# EAGLE design SC01 Breakout V0.1 (EAGLE 9.6.2)

## Sheet 1 of 2: Circuit Diagram
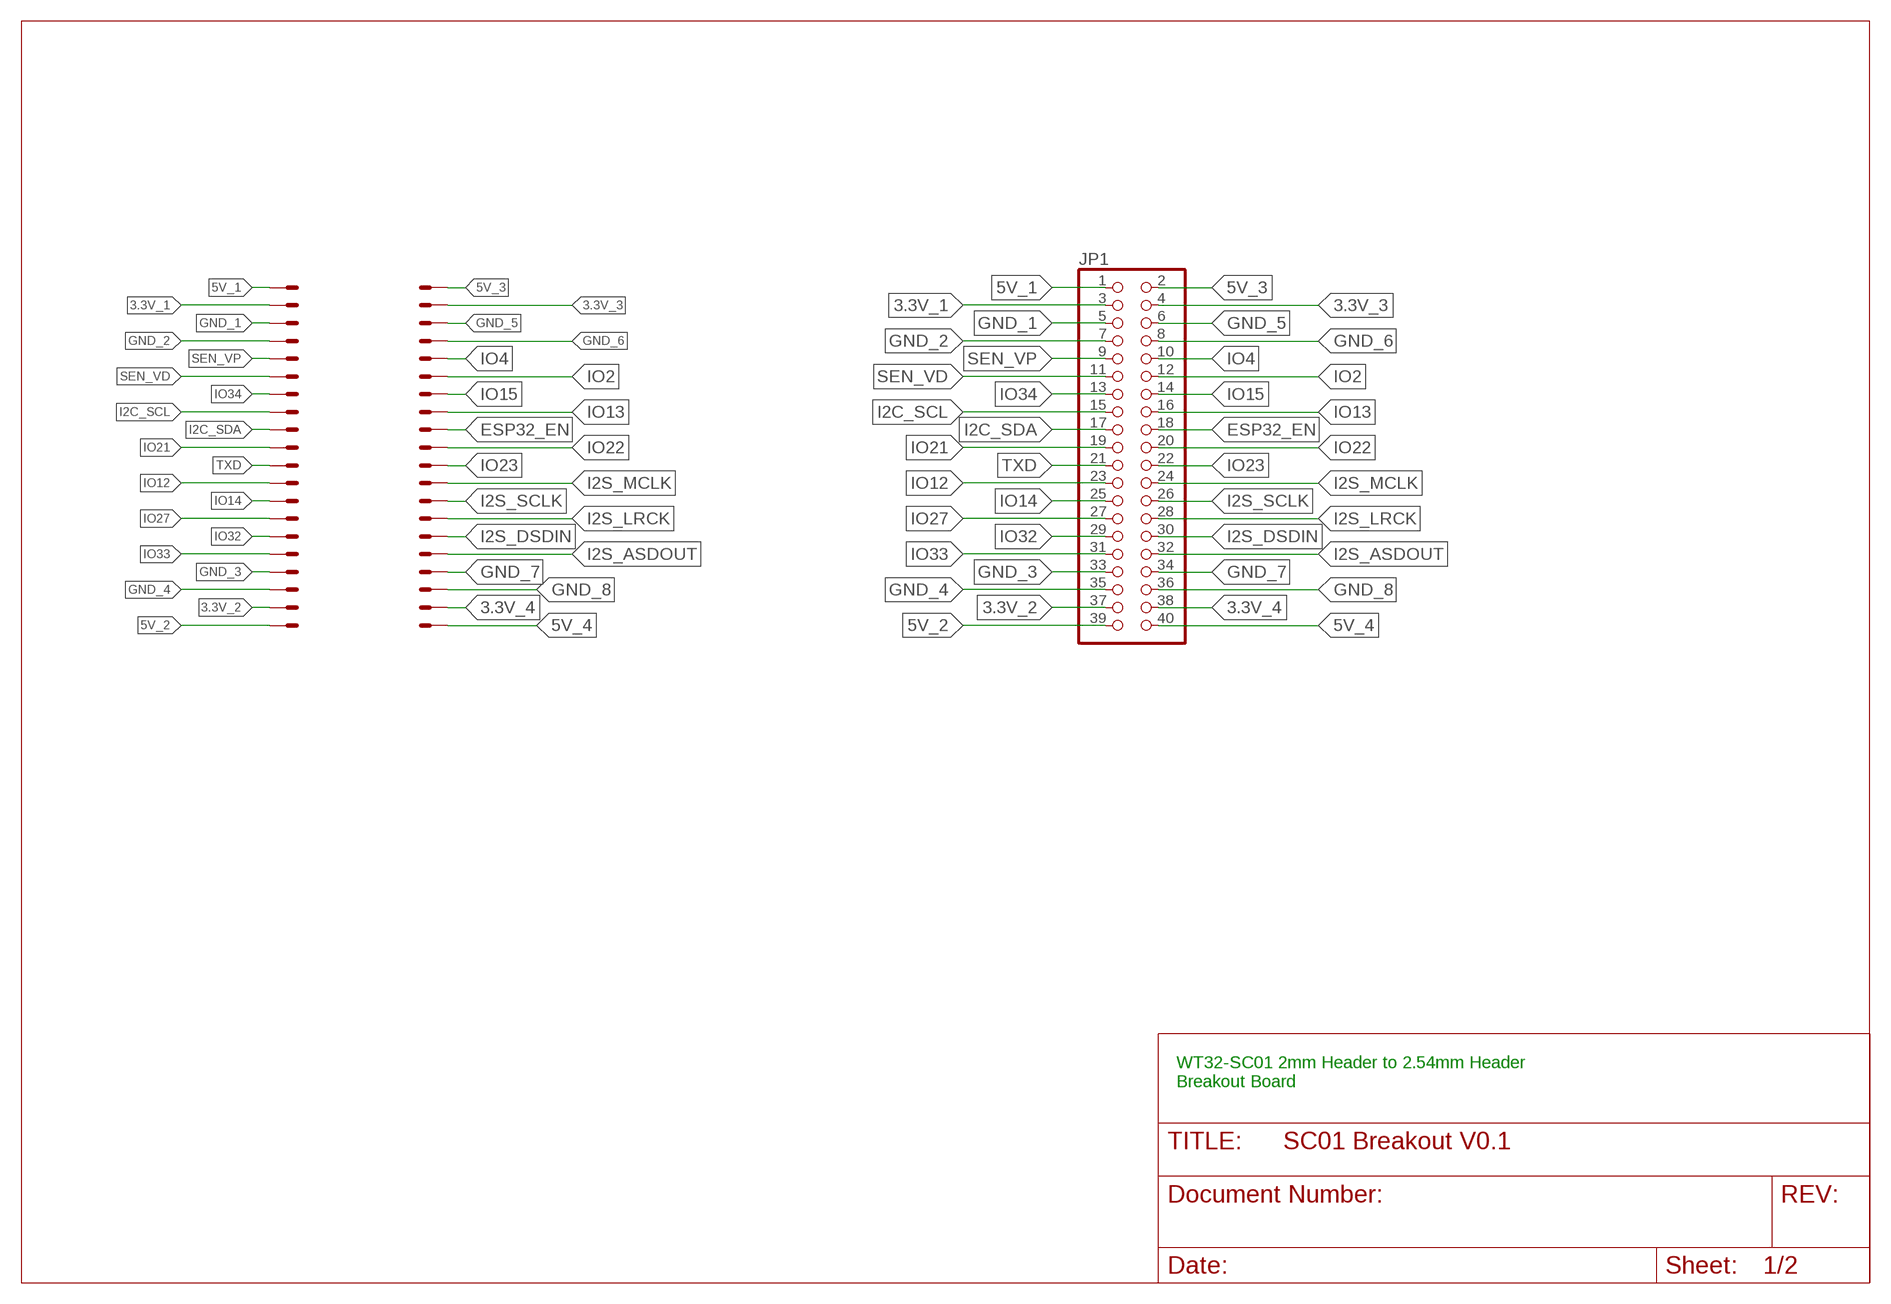
[diagram p0: schematic, sheet 1]

### Parts
JP1  PINHD-2X20  [2X20]
X1  87758-4016  [87758-4016]

### Nets
3.3V_1: JP1.3 X1.3
3.3V_2: JP1.37 X1.37
3.3V_3: JP1.4 X1.4
3.3V_4: JP1.38 X1.38
5V_1: JP1.1 X1.1
5V_2: JP1.39 X1.39
5V_3: JP1.2 X1.2
5V_4: JP1.40 X1.40
ESP32_EN: JP1.18 X1.18
GND_1: JP1.5 X1.5
GND_2: JP1.7 X1.7
GND_3: JP1.33 X1.33
GND_4: JP1.35 X1.35
GND_5: JP1.6 X1.6
GND_6: JP1.8 X1.8
GND_7: JP1.34 X1.34
GND_8: JP1.36 X1.36
I2C_SCL: JP1.15 X1.15
I2C_SDA: JP1.17 X1.17
I2S_ASDOUT: JP1.32 X1.32
I2S_DSDIN: JP1.30 X1.30
I2S_LRCK: JP1.28 X1.28
I2S_MCLK: JP1.24 X1.24
I2S_SCLK: JP1.26 X1.26
IO2: JP1.12 X1.12
IO4: JP1.10 X1.10
IO12: JP1.23 X1.23
IO13: JP1.16 X1.16
IO14: JP1.25 X1.25
IO15: JP1.14 X1.14
IO21: JP1.19 X1.19
IO22: JP1.20 X1.20
IO23: JP1.22 X1.22
IO27: JP1.27 X1.27
IO32: JP1.29 X1.29
IO33: JP1.31 X1.31
IO34: JP1.13 X1.13
SEN_VD: JP1.11 X1.11
SEN_VP: JP1.9 X1.9
TXD: JP1.21 X1.21

### Notes on the sheet
- WT32-SC01 2mm Header to 2.54mm Header
  Breakout Board

## Sheet 2 of 2
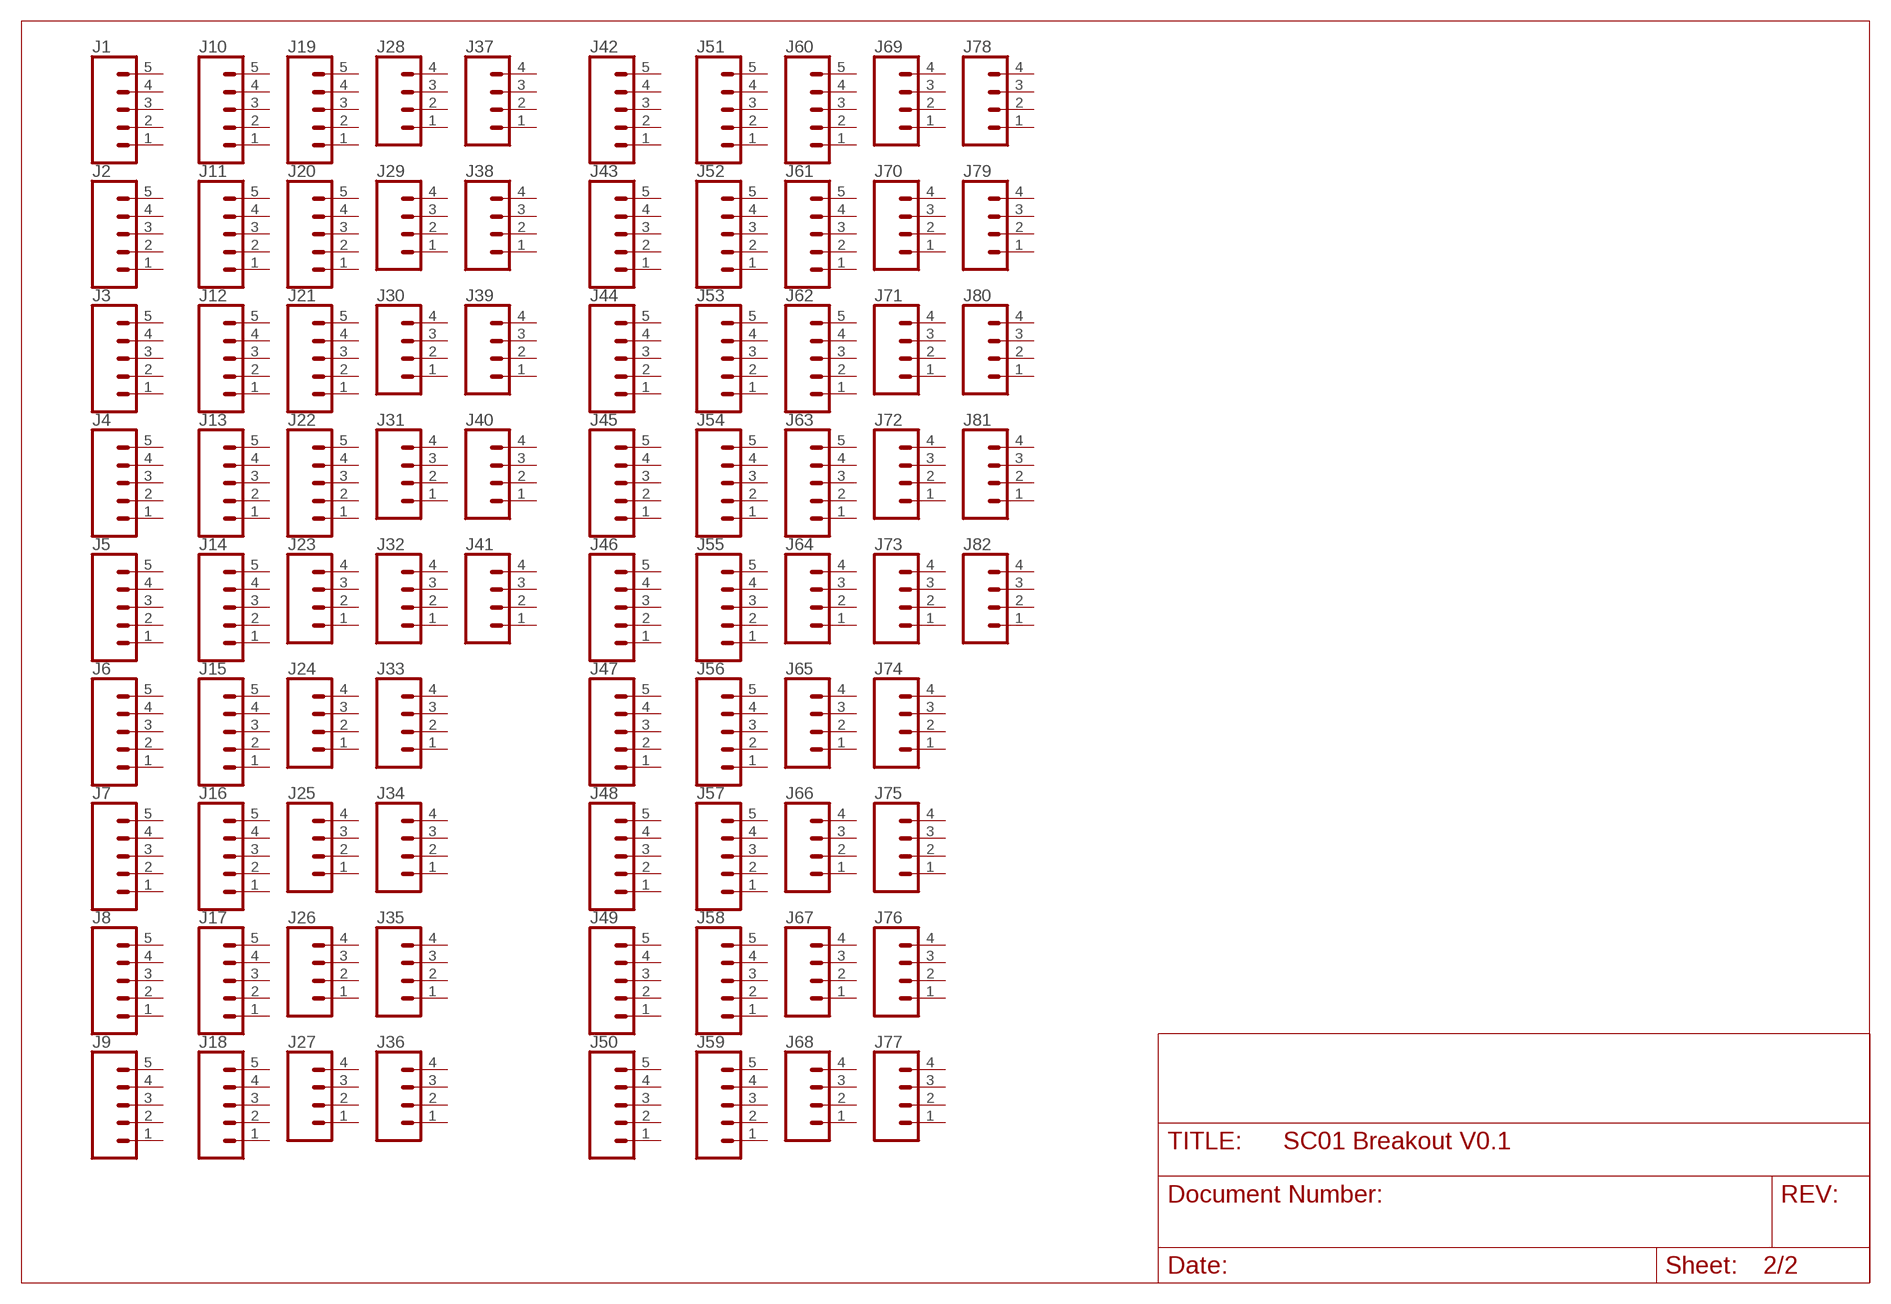
[diagram p1: schematic, sheet 2]

### Parts
J1  CONN_05NO_SILK  [1X05_NO_SILK]
J2  CONN_05NO_SILK  [1X05_NO_SILK]
J3  CONN_05NO_SILK  [1X05_NO_SILK]
J4  CONN_05NO_SILK  [1X05_NO_SILK]
J5  CONN_05NO_SILK  [1X05_NO_SILK]
J6  CONN_05NO_SILK  [1X05_NO_SILK]
J7  CONN_05NO_SILK  [1X05_NO_SILK]
J8  CONN_05NO_SILK  [1X05_NO_SILK]
J9  CONN_05NO_SILK  [1X05_NO_SILK]
J10  CONN_05NO_SILK  [1X05_NO_SILK]
J11  CONN_05NO_SILK  [1X05_NO_SILK]
J12  CONN_05NO_SILK  [1X05_NO_SILK]
J13  CONN_05NO_SILK  [1X05_NO_SILK]
J14  CONN_05NO_SILK  [1X05_NO_SILK]
J15  CONN_05NO_SILK  [1X05_NO_SILK]
J16  CONN_05NO_SILK  [1X05_NO_SILK]
J17  CONN_05NO_SILK  [1X05_NO_SILK]
J18  CONN_05NO_SILK  [1X05_NO_SILK]
J19  CONN_05NO_SILK  [1X05_NO_SILK]
J20  CONN_05NO_SILK  [1X05_NO_SILK]
J21  CONN_05NO_SILK  [1X05_NO_SILK]
J22  CONN_05NO_SILK  [1X05_NO_SILK]
J23  CONN_041X04_NO_SILK  [1X04_NO_SILK]
J24  CONN_041X04_NO_SILK  [1X04_NO_SILK]
J25  CONN_041X04_NO_SILK  [1X04_NO_SILK]
J26  CONN_041X04_NO_SILK  [1X04_NO_SILK]
J27  CONN_041X04_NO_SILK  [1X04_NO_SILK]
J28  CONN_041X04_NO_SILK  [1X04_NO_SILK]
J29  CONN_041X04_NO_SILK  [1X04_NO_SILK]
J30  CONN_041X04_NO_SILK  [1X04_NO_SILK]
J31  CONN_041X04_NO_SILK  [1X04_NO_SILK]
J32  CONN_041X04_NO_SILK  [1X04_NO_SILK]
J33  CONN_041X04_NO_SILK  [1X04_NO_SILK]
J34  CONN_041X04_NO_SILK  [1X04_NO_SILK]
J35  CONN_041X04_NO_SILK  [1X04_NO_SILK]
J36  CONN_041X04_NO_SILK  [1X04_NO_SILK]
J37  CONN_041X04_NO_SILK  [1X04_NO_SILK]
J38  CONN_041X04_NO_SILK  [1X04_NO_SILK]
J39  CONN_041X04_NO_SILK  [1X04_NO_SILK]
J40  CONN_041X04_NO_SILK  [1X04_NO_SILK]
J41  CONN_041X04_NO_SILK  [1X04_NO_SILK]
J42  CONN_05NO_SILK  [1X05_NO_SILK]
J43  CONN_05NO_SILK  [1X05_NO_SILK]
J44  CONN_05NO_SILK  [1X05_NO_SILK]
J45  CONN_05NO_SILK  [1X05_NO_SILK]
J46  CONN_05NO_SILK  [1X05_NO_SILK]
J47  CONN_05NO_SILK  [1X05_NO_SILK]
J48  CONN_05NO_SILK  [1X05_NO_SILK]
J49  CONN_05NO_SILK  [1X05_NO_SILK]
J50  CONN_05NO_SILK  [1X05_NO_SILK]
J51  CONN_05NO_SILK  [1X05_NO_SILK]
J52  CONN_05NO_SILK  [1X05_NO_SILK]
J53  CONN_05NO_SILK  [1X05_NO_SILK]
J54  CONN_05NO_SILK  [1X05_NO_SILK]
J55  CONN_05NO_SILK  [1X05_NO_SILK]
J56  CONN_05NO_SILK  [1X05_NO_SILK]
J57  CONN_05NO_SILK  [1X05_NO_SILK]
J58  CONN_05NO_SILK  [1X05_NO_SILK]
J59  CONN_05NO_SILK  [1X05_NO_SILK]
J60  CONN_05NO_SILK  [1X05_NO_SILK]
J61  CONN_05NO_SILK  [1X05_NO_SILK]
J62  CONN_05NO_SILK  [1X05_NO_SILK]
J63  CONN_05NO_SILK  [1X05_NO_SILK]
J64  CONN_041X04_NO_SILK  [1X04_NO_SILK]
J65  CONN_041X04_NO_SILK  [1X04_NO_SILK]
J66  CONN_041X04_NO_SILK  [1X04_NO_SILK]
J67  CONN_041X04_NO_SILK  [1X04_NO_SILK]
J68  CONN_041X04_NO_SILK  [1X04_NO_SILK]
J69  CONN_041X04_NO_SILK  [1X04_NO_SILK]
J70  CONN_041X04_NO_SILK  [1X04_NO_SILK]
J71  CONN_041X04_NO_SILK  [1X04_NO_SILK]
J72  CONN_041X04_NO_SILK  [1X04_NO_SILK]
J73  CONN_041X04_NO_SILK  [1X04_NO_SILK]
J74  CONN_041X04_NO_SILK  [1X04_NO_SILK]
J75  CONN_041X04_NO_SILK  [1X04_NO_SILK]
J76  CONN_041X04_NO_SILK  [1X04_NO_SILK]
J77  CONN_041X04_NO_SILK  [1X04_NO_SILK]
J78  CONN_041X04_NO_SILK  [1X04_NO_SILK]
J79  CONN_041X04_NO_SILK  [1X04_NO_SILK]
J80  CONN_041X04_NO_SILK  [1X04_NO_SILK]
J81  CONN_041X04_NO_SILK  [1X04_NO_SILK]
J82  CONN_041X04_NO_SILK  [1X04_NO_SILK]
Unconnected: J1.1 J1.2 J1.3 J1.4 J1.5 J2.1 J2.2 J2.3 J2.4 J2.5 J3.1 J3.2 J3.3 J3.4 J3.5 J4.1 J4.2 J4.3 J4.4 J4.5 J5.1 J5.2 J5.3 J5.4 J5.5 J6.1 J6.2 J6.3 J6.4 J6.5 J7.1 J7.2 J7.3 J7.4 J7.5 J8.1 J8.2 J8.3 J8.4 J8.5 J9.1 J9.2 J9.3 J9.4 J9.5 J10.1 J10.2 J10.3 J10.4 J10.5 J11.1 J11.2 J11.3 J11.4 J11.5 J12.1 J12.2 J12.3 J12.4 J12.5 J13.1 J13.2 J13.3 J13.4 J13.5 J14.1 J14.2 J14.3 J14.4 J14.5 J15.1 J15.2 J15.3 J15.4 J15.5 J16.1 J16.2 J16.3 J16.4 J16.5 J17.1 J17.2 J17.3 J17.4 J17.5 J18.1 J18.2 J18.3 J18.4 J18.5 J19.1 J19.2 J19.3 J19.4 J19.5 J20.1 J20.2 J20.3 J20.4 J20.5 J21.1 J21.2 J21.3 J21.4 J21.5 J22.1 J22.2 J22.3 J22.4 J22.5 J23.1 J23.2 J23.3 J23.4 J24.1 J24.2 J24.3 J24.4 J25.1 J25.2 J25.3 J25.4 J26.1 J26.2 J26.3 J26.4 J27.1 J27.2 J27.3 J27.4 J28.1 J28.2 J28.3 J28.4 J29.1 J29.2 J29.3 J29.4 J30.1 J30.2 J30.3 J30.4 J31.1 J31.2 J31.3 J31.4 J32.1 J32.2 J32.3 J32.4 J33.1 J33.2 J33.3 J33.4 J34.1 J34.2 J34.3 J34.4 J35.1 J35.2 J35.3 J35.4 J36.1 J36.2 J36.3 J36.4 J37.1 J37.2 J37.3 J37.4 J38.1 J38.2 J38.3 J38.4 J39.1 J39.2 J39.3 J39.4 J40.1 J40.2 J40.3 J40.4 J41.1 J41.2 J41.3 J41.4 J42.1 J42.2 J42.3 J42.4 J42.5 J43.1 J43.2 J43.3 J43.4 J43.5 J44.1 J44.2 J44.3 J44.4 J44.5 J45.1 J45.2 J45.3 J45.4 J45.5 J46.1 J46.2 J46.3 J46.4 J46.5 J47.1 J47.2 J47.3 J47.4 J47.5 J48.1 J48.2 J48.3 J48.4 J48.5 J49.1 J49.2 J49.3 J49.4 J49.5 J50.1 J50.2 J50.3 J50.4 J50.5 J51.1 J51.2 J51.3 J51.4 J51.5 J52.1 J52.2 J52.3 J52.4 J52.5 J53.1 J53.2 J53.3 J53.4 J53.5 J54.1 J54.2 J54.3 J54.4 J54.5 J55.1 J55.2 J55.3 J55.4 J55.5 J56.1 J56.2 J56.3 J56.4 J56.5 J57.1 J57.2 J57.3 J57.4 J57.5 J58.1 J58.2 J58.3 J58.4 J58.5 J59.1 J59.2 J59.3 J59.4 J59.5 J60.1 J60.2 J60.3 J60.4 J60.5 J61.1 J61.2 J61.3 J61.4 J61.5 J62.1 J62.2 J62.3 J62.4 J62.5 J63.1 J63.2 J63.3 J63.4 J63.5 J64.1 J64.2 J64.3 J64.4 J65.1 J65.2 J65.3 J65.4 J66.1 J66.2 J66.3 J66.4 J67.1 J67.2 J67.3 J67.4 J68.1 J68.2 J68.3 J68.4 J69.1 J69.2 J69.3 J69.4 J70.1 J70.2 J70.3 J70.4 J71.1 J71.2 J71.3 J71.4 J72.1 J72.2 J72.3 J72.4 J73.1 J73.2 J73.3 J73.4 J74.1 J74.2 J74.3 J74.4 J75.1 J75.2 J75.3 J75.4 J76.1 J76.2 J76.3 J76.4 J77.1 J77.2 J77.3 J77.4 J78.1 J78.2 J78.3 J78.4 J79.1 J79.2 J79.3 J79.4 J80.1 J80.2 J80.3 J80.4 J81.1 J81.2 J81.3 J81.4 J82.1 J82.2 J82.3 J82.4

## Library data of the parts
J1-J22 J42-J63 = SparkFun-Connectors:CONN_05: Multi connection point. Often used as Generic Header-pin footprint for 0.1 inch spaced/style header connections On any of the 0.1 inch spaced packages, you can populate with these: Break Away Headers - Straight <https://www.sparkfun.com/products/116> (PRT-00116) Break Away Male Headers - Right Angle <https://www.sparkfun.com/products/553> (PRT-00553) Female Headers <https://www.sparkfun.com/products/115> (PRT-00115) Break Away Headers - Machine Pin <https://www.sparkfun.com/products/117> (PRT-00117) Break Away Female Headers - Swiss Machine Pin <https://www.sparkfun.com/products/743> (PRT-00743) For SCREWTERMINALS and SPRING TERMINALS visit here: Screw Terimnals on SparkFun.com <https://www.sparkfun.com/search/results?term=Screw+Terminals> (5mm/3.5mm/2.54mm spacing) This device is also useful as a general connection point to wire up your design to another part of your project. Our various solder wires solder well into these plated through hole pads. Hook-Up Wire - Assortment (Stranded, 22 AWG) <https://www.sparkfun.com/products/11375> (PRT-11375) Hook-Up Wire - Assortment (Solid Core, 22 AWG) <https://www.sparkfun.com/products/11367> (PRT-11367) View the entire wire category on our website here <https://www.sparkfun.com/categories/141> Special notes: Molex polarized connector foot print use with SKU : PRT-08231 with associated crimp pins and housings. 1MM SMD Version SKU: PRT-10208
J23-J41 J64-J82 = SparkFun-Connectors:CONN_04: Multi connection point. Often used as Generic Header-pin footprint for 0.1 inch spaced/style header connections On any of the 0.1 inch spaced packages, you can populate with these: Break Away Headers - Straight <https://www.sparkfun.com/products/116> (PRT-00116) Break Away Male Headers - Right Angle <https://www.sparkfun.com/products/553> (PRT-00553) Female Headers <https://www.sparkfun.com/products/115> (PRT-00115) Break Away Headers - Machine Pin <https://www.sparkfun.com/products/117> (PRT-00117) Break Away Female Headers - Swiss Machine Pin <https://www.sparkfun.com/products/743> (PRT-00743) For SCREWTERMINALS and SPRING TERMINALS visit here: Screw Terimnals on SparkFun.com <https://www.sparkfun.com/search/results?term=Screw+Terminals> (5mm/3.5mm/2.54mm spacing) This device is also useful as a general connection point to wire up your design to another part of your project. Our various solder wires solder well into these plated through hole pads. Hook-Up Wire - Assortment (Stranded, 22 AWG) <https://www.sparkfun.com/products/11375> (PRT-11375) Hook-Up Wire - Assortment (Solid Core, 22 AWG) <https://www.sparkfun.com/products/11367> (PRT-11367) View the entire wire category on our website here <https://www.sparkfun.com/categories/141> Special notes: Molex polarized connector foot print use with SKU : PRT-08231 with associated crimp pins and housings. 1MM SMD Version SKU: PRT-10208; PROD_ID: CONN-09696
JP1 = pinhead:PINHD-2X20: PIN HEADER
X1 = con-molex:87758-4016: 40 Pin - 2mm Dual Row Single Wafer, Vertical T/H HDR Source: http://www.molex.com/pdm_docs/sd/877580616_sd.pdf; MPN: 87758-4016; OC_FARNELL: unknown; OC_NEWARK: 25M5691

## Board
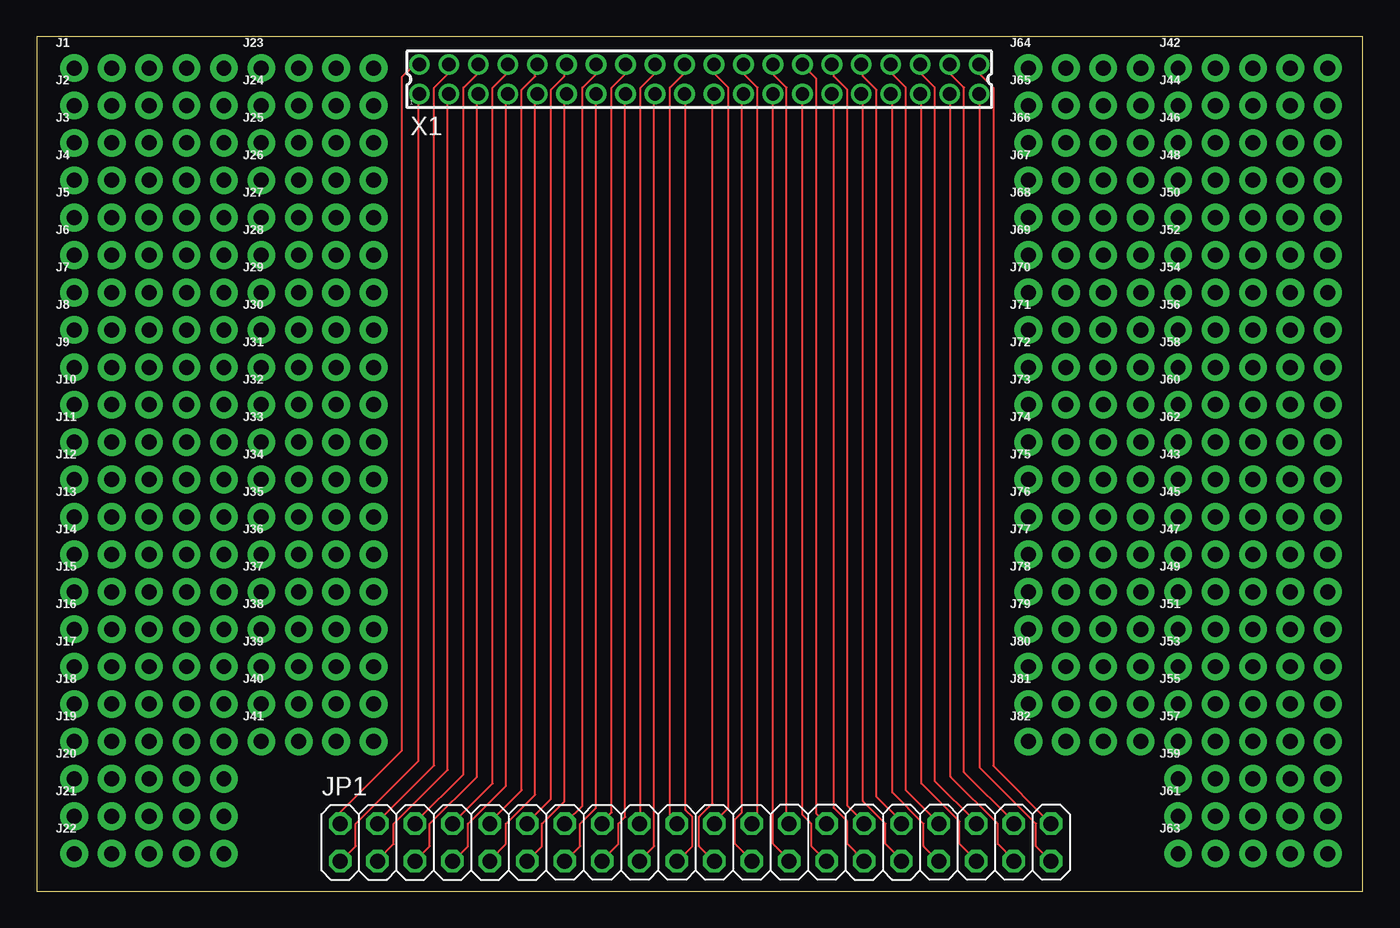
[diagram p2: board, top side]

Size 90 x 58 mm. Coordinates in mm from the lower left corner, seen from the top.
Outline: 0,0 90,0 90,58 0,58 0,0
Copper layers (1*16): Top 0.035mm / dielectric 1.5mm / Bottom 0.035mm
Design rules "default": minimum track width 6mil, minimum drill 0.35mm, track to track 6mil, track to pad 6mil, pad to pad 6mil, via to via 6mil, smd to smd 6mil, copper to edge 40mil, drill to drill 6mil, minimum pad ring 10mil, minimum via ring 8mil, stop-mask expansion 4mil, vias tented up to drill 0mil, thermal gap 10mil

### Footprints (pad centres in the part's own frame; a part is rotated, then mirrored left to right if it is on the bottom)
1X05_NO_SILK = drill 1.016 pad 1.88: 1 0,0; 2 2.54,0; 3 5.08,0; 4 7.62,0; 5 10.16,0
1X04_NO_SILK = drill 1.016 pad 1.88: 1 0,0; 2 2.54,0; 3 5.08,0; 4 7.62,0
2X20 = drill 1.016 octagon: 1 -24.13,-1.27; 2 -24.13,1.27; 3 -21.59,-1.27; 4 -21.59,1.27; 5 -19.05,-1.27; 6 -19.05,1.27; 7 -16.51,-1.27; 8 -16.51,1.27; 9 -13.97,-1.27; 10 -13.97,1.27; 11 -11.43,-1.27; 12 -11.43,1.27; 13 -8.89,-1.27; 14 -8.89,1.27; 15 -6.35,-1.27; 16 -6.35,1.27; 17 -3.81,-1.27; 18 -3.81,1.27; 19 -1.27,-1.27; 20 -1.27,1.27; 21 1.27,-1.27; 22 1.27,1.27; 23 3.81,-1.27; 24 3.81,1.27; 25 6.35,-1.27; 26 6.35,1.27; 27 8.89,-1.27; 28 8.89,1.27; 29 11.43,-1.27; 30 11.43,1.27; 31 13.97,-1.27; 32 13.97,1.27; 33 16.51,-1.27; 34 16.51,1.27; 35 19.05,-1.27; 36 19.05,1.27; 37 21.59,-1.27; 38 21.59,1.27; 39 24.13,-1.27; 40 24.13,1.27
87758-4016 = drill 0.9 pad 1.27: 1 -19,-1; 2 -19,1; 3 -17,-1; 4 -17,1; 5 -15,-1; 6 -15,1; 7 -13,-1; 8 -13,1; 9 -11,-1; 10 -11,1; 11 -9,-1; 12 -9,1; 13 -7,-1; 14 -7,1; 15 -5,-1; 16 -5,1; 17 -3,-1; 18 -3,1; 19 -1,-1; 20 -1,1; 21 1,-1; 22 1,1; 23 3,-1; 24 3,1; 25 5,-1; 26 5,1; 27 7,-1; 28 7,1; 29 9,-1; 30 9,1; 31 11,-1; 32 11,1; 33 13,-1; 34 13,1; 35 15,-1; 36 15,1; 37 17,-1; 38 17,1; 39 19,-1; 40 19,1

### Placement (x,y rotation side)
J1  2.54,55.88 0 top
J2  2.54,53.34 0 top
J3  2.54,50.8 0 top
J4  2.54,48.26 0 top
J5  2.54,45.72 0 top
J6  2.54,43.18 0 top
J7  2.54,40.64 0 top
J8  2.54,38.1 0 top
J9  2.54,35.56 0 top
J10  2.54,33.02 0 top
J11  2.54,30.48 0 top
J12  2.54,27.94 0 top
J13  2.54,25.4 0 top
J14  2.54,22.86 0 top
J15  2.54,20.32 0 top
J16  2.54,17.78 0 top
J17  2.54,15.24 0 top
J18  2.54,12.7 0 top
J19  2.54,10.16 0 top
J20  2.54,7.62 0 top
J21  2.54,5.08 0 top
J22  2.54,2.54 0 top
J23  15.24,55.88 0 top
J24  15.24,53.34 0 top
J25  15.24,50.8 0 top
J26  15.24,48.26 0 top
J27  15.24,45.72 0 top
J28  15.24,43.18 0 top
J29  15.24,40.64 0 top
J30  15.24,38.1 0 top
J31  15.24,35.56 0 top
J32  15.24,33.02 0 top
J33  15.24,30.48 0 top
J34  15.24,27.94 0 top
J35  15.24,25.4 0 top
J36  15.24,22.86 0 top
J37  15.24,20.32 0 top
J38  15.24,17.78 0 top
J39  15.24,15.24 0 top
J40  15.24,12.7 0 top
J41  15.24,10.16 0 top
J42  77.47,55.88 0 top
J43  77.47,27.94 0 top
J44  77.47,53.34 0 top
J45  77.47,25.4 0 top
J46  77.47,50.8 0 top
J47  77.47,22.86 0 top
J48  77.47,48.26 0 top
J49  77.47,20.32 0 top
J50  77.47,45.72 0 top
J51  77.47,17.78 0 top
J52  77.47,43.18 0 top
J53  77.47,15.24 0 top
J54  77.47,40.64 0 top
J55  77.47,12.7 0 top
J56  77.47,38.1 0 top
J57  77.47,10.16 0 top
J58  77.47,35.56 0 top
J59  77.47,7.62 0 top
J60  77.47,33.02 0 top
J61  77.47,5.08 0 top
J62  77.47,30.48 0 top
J63  77.47,2.54 0 top
J64  67.31,55.88 0 top
J65  67.31,53.34 0 top
J66  67.31,50.8 0 top
J67  67.31,48.26 0 top
J68  67.31,45.72 0 top
J69  67.31,43.18 0 top
J70  67.31,40.64 0 top
J71  67.31,38.1 0 top
J72  67.31,35.56 0 top
J73  67.31,33.02 0 top
J74  67.31,30.48 0 top
J75  67.31,27.94 0 top
J76  67.31,25.4 0 top
J77  67.31,22.86 0 top
J78  67.31,20.32 0 top
J79  67.31,17.78 0 top
J80  67.31,15.24 0 top
J81  67.31,12.7 0 top
J82  67.31,10.16 0 top
JP1  44.72,3.31 0 top
X1  44.97,55.12 0 top

### Tracks (layer width: path | path; a pad name or v marks a point on that pad's centre or on a via)
3.3V_1
  Top 0.152: X1.3 27.89,54.1 27.89,8.23 24.23,4.57 24.23,3.2 23.16,2.13 JP1.3
3.3V_2
  Top 0.152: X1.37 62.03,54.1 62.03,7.77 65.23,4.57 65.23,3.2 66.29,2.13 JP1.37
3.3V_3
  Top 0.152: X1.4 27.89,56.08 27.89,55.47 26.98,54.56 26.98,8.53 23.16,4.72 JP1.4
3.3V_4
  Top 0.152: X1.38 62.03,56.08 62.03,55.47 62.94,54.56 62.94,8.08 66.29,4.72 JP1.38
5V_1
  Top 0.152: X1.1 25.91,54.1 25.91,8.84 21.64,4.57 21.64,3.05 20.73,2.13 JP1.1
5V_2
  Top 0.152: X1.39 64.01,54.1 64.01,8.38 67.82,4.57 67.82,3.05 68.73,2.13 JP1.39
5V_3
  Top 0.152: X1.2 25.73,55.88 25.4,55.88 24.77,55.24 24.77,9.53 20.59,5.35 JP1.2
5V_4
  Top 0.152: X1.40 64.01,56.08 64.01,55.47 64.92,54.56 64.92,8.51 JP1.40
ESP32_EN
  Top 0.152: X1.18 41.91,56.08 41.91,55.47 41,54.56 41,4.72 JP1.18
GND_1
  Top 0.152: X1.5 29.87,54.1 29.87,7.77 26.67,4.57 26.67,3.05 25.76,2.13 JP1.5
GND_2
  Top 0.152: X1.7 31.85,54.1 31.85,7.16 29.26,4.57 29.26,3.05 28.35,2.13 JP1.7
GND_3
  Top 0.152: X1.33 58.06,54.1 58.06,6.71 60.2,4.57 60.2,3.05 61.11,2.13 JP1.33
GND_4
  Top 0.152: X1.35 60.05,54.1 60.05,7.32 62.64,4.72 62.64,3.2 63.7,2.13 JP1.35
GND_5
  Top 0.152: X1.6 29.87,56.08 29.87,55.47 28.96,54.56 28.96,7.92 25.76,4.72 JP1.6
GND_6
  Top 0.152: X1.8 31.85,56.08 31.85,55.47 30.94,54.56 30.94,7.32 28.35,4.72 JP1.8
GND_7
  Top 0.152: X1.34 58.06,56.08 58.06,55.47 58.98,54.56 58.98,6.86 61.11,4.72 JP1.34
GND_8
  Top 0.152: X1.36 60.05,56.08 60.05,55.47 60.96,54.56 60.96,7.47 63.7,4.72 JP1.36
I2C_SCL
  Top 0.152: X1.15 39.93,54.1 39.93,5.03 39.47,4.57 39.47,3.2 38.41,2.13 JP1.15
I2C_SDA
  Top 0.152: X1.17 41.91,54.1 41.91,3.05 41,2.13 JP1.17
I2S_ASDOUT
  Top 0.152: X1.32 56.08,56.08 56.08,55.32 57,54.41 57,6.4 58.67,4.72 JP1.32
I2S_DSDIN
  Top 0.152: X1.30 54.1,56.08 54.1,55.32 55.02,54.41 55.02,5.79 56.08,4.72 JP1.30
I2S_LRCK
  Top 0.152: X1.28 52.9,55.19 52.9,5.29 JP1.28
I2S_MCLK
  Top 0.152: X1.24 48.01,56.08 48.01,55.47 48.92,54.56 48.92,5.03 48.62,4.72 JP1.24
I2S_SCLK
  Top 0.152: X1.26 49.99,56.08 49.99,55.47 50.9,54.56 50.9,4.88 51.05,4.72 JP1.26
IO2
  Top 0.152: X1.12 35.81,56.08 35.81,55.32 34.9,54.41 34.9,6.25 33.38,4.72 JP1.12
IO4
  Top 0.152: X1.10 33.83,56.08 33.83,55.32 32.92,54.41 32.92,6.86 30.79,4.72 JP1.10
IO12
  Top 0.152: X1.23 47.85,54.1 47.85,5.33 47.4,4.88 47.4,3.2 48.46,2.13 JP1.23
IO13
  Top 0.152: X1.16 39.93,56.08 39.93,55.47 39.01,54.56 39.01,5.33 38.41,4.72 JP1.16
IO14
  Top 0.152: X1.25 49.99,54.1 49.99,3.2 51.05,2.13 JP1.25
IO15
  Top 0.152: X1.14 37.95,56.08 37.95,55.47 37.03,54.56 37.03,5.79 35.97,4.72 JP1.14
IO21
  Top 0.152: X1.19 44.04,54.1 44.04,5.49 44.5,5.03 44.5,3.05 43.59,2.13 JP1.19
IO22
  Top 0.152: X1.20 43.89,56.08 43.89,55.47 42.98,54.56 42.98,5.18 43.43,4.72 JP1.20
IO23
  Top 0.152: X1.22 46.02,56.08 46.02,55.47 46.94,54.56 46.94,5.64 46.02,4.72 JP1.22
IO27
  Top 0.152: X1.27 51.97,54.1 51.97,5.18 52.58,4.57 52.58,3.05 53.49,2.13 JP1.27
IO32
  Top 0.152: X1.29 54.1,54.1 54.1,5.64 55.02,4.72 55.02,3.2 56.08,2.13 JP1.29
IO33
  Top 0.152: X1.31 56.08,54.1 56.08,6.1 57.61,4.57 57.61,3.2 58.67,2.13 JP1.31
IO34
  Top 0.152: X1.13 37.95,54.1 37.95,5.64 36.88,4.57 36.88,3.05 35.97,2.13 JP1.13
SEN_VD
  Top 0.152: X1.11 35.81,54.1 35.81,6.1 34.29,4.57 34.29,3.05 33.38,2.13 JP1.11
SEN_VP
  Top 0.152: X1.9 33.83,54.1 33.83,6.55 31.85,4.57 31.85,3.2 30.79,2.13 JP1.9
TXD
  Top 0.152: X1.21 45.87,54.1 45.87,5.94 44.96,5.03 44.96,3.05 45.87,2.13 JP1.21